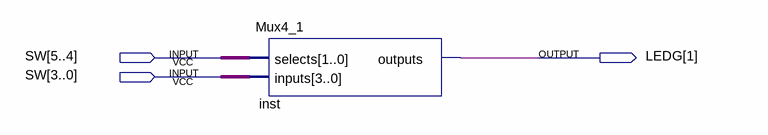
[diagram p0: schematic sheet]
// Quartus schematic Mux4_1Demo.bdf as structural Verilog: 1 symbols, 3 pins
module Mux4_1Demo (
  input  [5:0] SW,
  output [1:1] LEDG
);

  Mux4_1 inst (.selects(SW[5:4]), .inputs(SW[3:0]), .outputs(LEDG[1]));
endmodule
